# Altium project Shot_bot_prototype_V1.PrjPcb
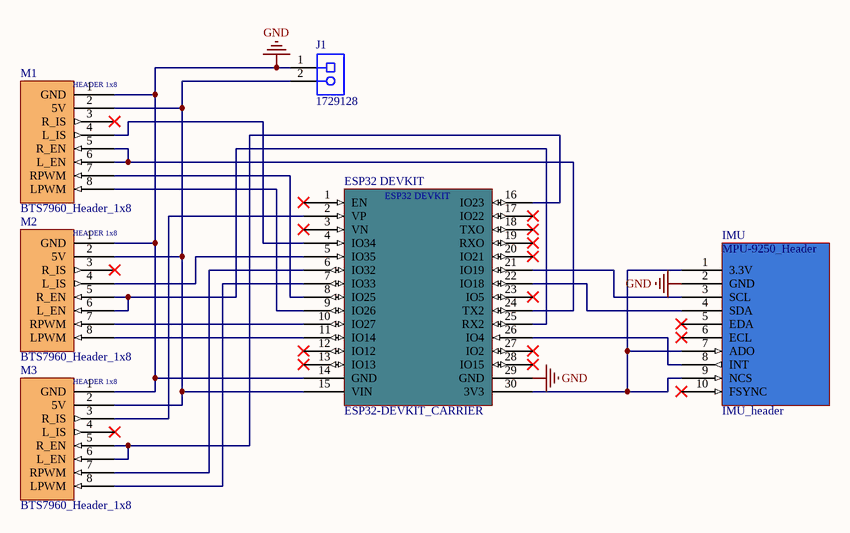
[diagram p0: Sheet1.SchDoc]
1 sheet, 6 parts. Net scope: global (net labels, ports and power ports of the same name join across sheets).
Board file: Shot_bot_PCB_V1.PcbDoc

## Sheet Sheet1.SchDoc
size A; SheetNumber: 1; SheetTotal: 1

### Parts
ESP32_DEVKIT  ESP32-DEVKIT_CARRIER  [ESP32_DEVKIT_CARRIER]
IMU  IMU_header  [PCBComponent_1]
J1  1729128  [PHOE-1729128-2_V]
M1  BTS7960_Header_1x8  [PCBComponent_1]
M2  BTS7960_Header_1x8  [PCBComponent_1]
M3  BTS7960_Header_1x8  [PCBComponent_1]

### Nets
GND: ESP32_DEVKIT.14(GND) ESP32_DEVKIT.29(GND) IMU.2(GND) J1.1(5V) M1.1(GND) M2.1(GND) M3.1(GND)
NetESP32_DEVKIT_2: ESP32_DEVKIT.2(VP) M3.3(R_IS)
NetESP32_DEVKIT_4: ESP32_DEVKIT.4(IO34) M1.4(L_IS)
NetESP32_DEVKIT_5: ESP32_DEVKIT.5(IO35) M2.4(L_IS)
NetESP32_DEVKIT_6: ESP32_DEVKIT.6(IO32) M3.7(RPWM)
NetESP32_DEVKIT_7: ESP32_DEVKIT.7(IO33) M3.8(LPWM)
NetESP32_DEVKIT_8: ESP32_DEVKIT.8(IO25) M1.7(RPWM)
NetESP32_DEVKIT_9: ESP32_DEVKIT.9(IO26) M1.8(LPWM)
NetESP32_DEVKIT_10: ESP32_DEVKIT.10(IO27) M2.7(RPWM)
NetESP32_DEVKIT_11: ESP32_DEVKIT.11(IO14) M2.8(LPWM)
NetESP32_DEVKIT_15: ESP32_DEVKIT.15(VIN) J1.2(GND) M1.2(5V) M2.2(5V) M3.2(5V)
NetESP32_DEVKIT_16: ESP32_DEVKIT.16(IO23) M3.5(R_EN) M3.6(L_EN)
NetESP32_DEVKIT_21: ESP32_DEVKIT.21(IO19) IMU.3(SCL)
NetESP32_DEVKIT_22: ESP32_DEVKIT.22(IO18) IMU.4(SDA)
NetESP32_DEVKIT_24: ESP32_DEVKIT.24(TX2) M1.5(R_EN) M1.6(L_EN)
NetESP32_DEVKIT_25: ESP32_DEVKIT.25(RX2) M2.5(R_EN) M2.6(L_EN)
NetESP32_DEVKIT_26: ESP32_DEVKIT.26(IO4) IMU.8(INT)
NetESP32_DEVKIT_30: ESP32_DEVKIT.30(3V3) IMU.1(3.3V) IMU.7(ADO) IMU.9(NCS)

Not connected (* = marked no-connect by the designer): ESP32_DEVKIT 1(EN)* 3(VN)* 12(IO12)* 13(IO13)* 17(IO22)* 18(TXO)* 19(RXO)* 20(IO21)* 23(IO5)* 27(IO2)* 28(IO15)*; IMU 5(EDA)* 6(ECL)* 10(FSYNC)*; M1 3(R_IS)*; M2 3(R_IS)*; M3 4(L_IS)*

### Notes on the sheet
- (in symbol BTS7960_Header_1x8) HEADER 1x8
- (in symbol IMU_header) MPU-9250_Header

### Library data of the parts
J1 = CMP-2000-05815-1: PCB Terminal Block, 13.5 A, 400 V, 2-Pin THD, RoHS, Bulk; Manufacturer: Phoenix Contact; Package Version: 03/2015; No. of Rows: 1; Pitch: 5.08mm; No. of Positions: 2; Voltage Rating: 400V; Current Rating: 13500mA; Manufacturer URL: http://www.phoenixcontact.com/; Datasheet URL: https://datasheet.ciiva.com/16046/1729128-16046181.pdf; RoHS: TRUE; Package URL: https://www.phoenixcontact.com/online/portal/pi/pxc/product_detail_page/!ut/p/b1/3VdJjqNKFDxLH8AFycySyWY2ozFsEPOMMQaDOX1XedGL_1Vdm5YXJleknhSKeBkvI6EA8ncAo3AYoDhBQGco6KN7VURTdemj9us_IEKEZo_YHiPAEWEFmDGOHMORkqKYCORBZxgL7ZoaZYcbFFUZ3fqxSY6GOuxydWUuHqz1ynmMFygu583Bob0Ewr6Sd_l-5m-kAueHiB0jpRwZwe58wwtkpxtMYd_LmGcDRU02dRNEyWt6Y2ti5pSyJ_reIkzIulrqApdnbT11V5jnCKbYNCvhEM1MCpPByat_X379-iThf08CI5GfOPqfBeS3BRoBOdD55AKVv0iLwCMq-2BrzXWSGRH7pUGD9uwXQjiph3xL0DKQwdGa0JImiIOmBNOestqgwTHSSs2oOep-78apyXQBvNi8ZLaFjvjWvcaUEBu0MC6Wbe-d6mB0FAebo2lUWinqYaZs5DAYzV0RP9yitUjnGJ0iI9xhZkT42OCQNUJJhkgWINNQLP2JFP6OpMg3JCVg70jqHT0lvKOnhHf0lPuOnnLf0VPuWx6_dxwUIvwk5WMkT0kLL1mh61l2yZVSzG3pYV_bqo-mj6uMKwKwdnnW8Jh5RTOJzMOA5c-eJDaZQw4mTMPH02PvS_ZAqNVjVTo2WyYLkwH_KU1mmmG5kjRhDqPXLwwVHvVOjCM60-fpXvTDfMGW1PVFVS1r4e4yVDk4ZdNbkUHvqPqQSeian4UD39fNKmachqdJ1NJbyk8rXT9mXTvPk3oE5meulKGgiruPJek-4I9hTT6G8ZLOyRSm2RRVbThERQad5OS28hdt4YW4vG0stgYYzsWsK4_7y6DZMjJSCqri1kyiZR5vD7pwIrNR7QwPHTcLTI5qT7eRlpHrdGiupYlqQDJ7zy_CND8fWWBoLRXxk1RVcXiBQwbTD4Xi7KL-FuO94t9xaqweXzH; PartNumber: 1729128; Package Description: 2-Pin Through Hole Device, Body 8.1 x 10.16 mm, Pitch 5.08 mm; Datasheet Version: 12/2013; Mounting Technology: ThroughHole; Orientation: Horizontal; Package Reference: 1729128-2; Packing: Bulk